# EAGLE schematic Dig_Stethoscope (EAGLE 9.0.1)
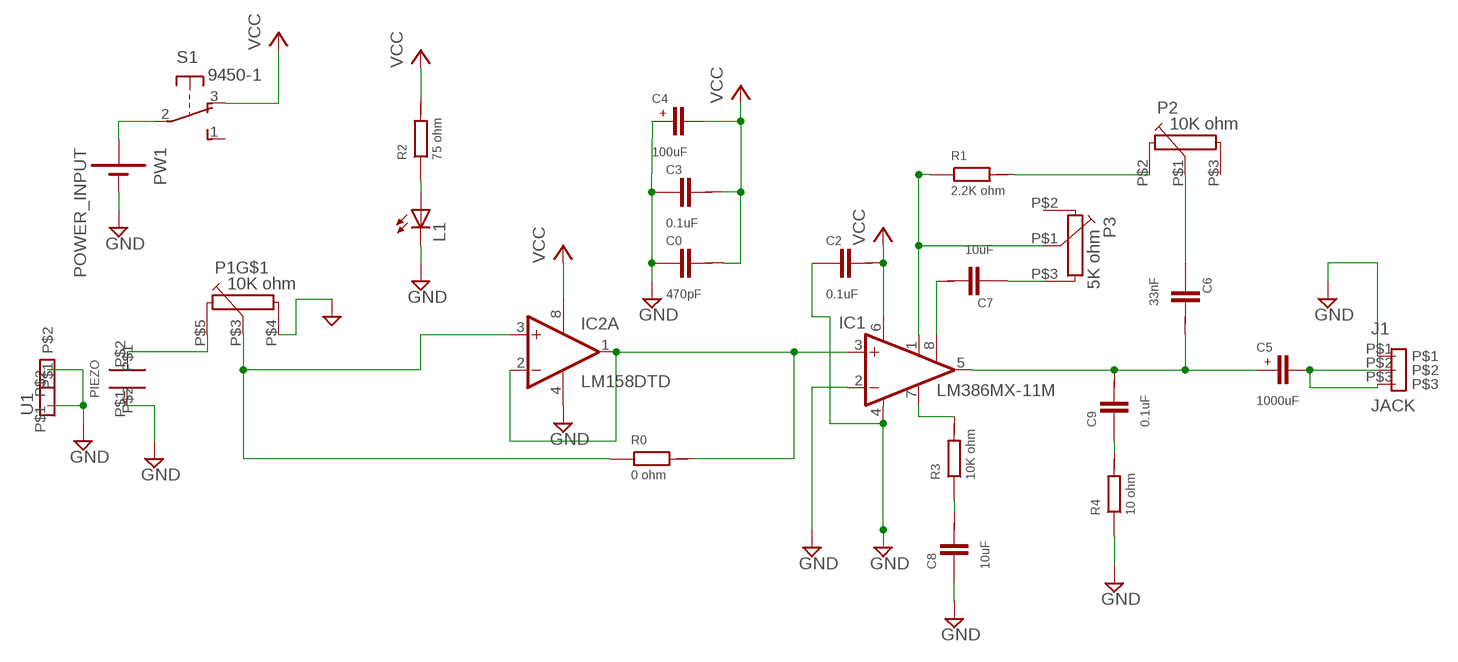
[diagram p0: schematic, sheet 1]

## Parts
C0  470pF  CAP_CERAMIC  [C0603K]
C2  0.1uF  CAP_CERAMIC  [C0603K]
C3  0.1uF  CAP_CERAMIC  [C0603K]
C4  100uF  CAP_100UF  [CAP_100UF]
C5  1000uF  CAP_1000UF  [CAP_1000F]
C6  33nF  CAP_CERAMIC  [C0603K]
C7  10uF  CAP_CERAMIC  [C0603K]
C8  10uF  CAP_CERAMIC  [C0603K]
C9  0.1uF  CAP_CERAMIC  [C0603K]
IC1  LM386MX-11M  [SO08]
IC2  LM158DTD  [SO08]
J1  JACK  [JACK]
L1  L140_LED  [LTW_LED]
P1  10K ohm  POT_DIP_REAR_MOUNT  [DIP_POT]
P2  10K ohm  TC33X-1/2  [TC33X-1/2]
P3  5K ohm  TC33X-1/2  [TC33X-1/2]
PIEZO  PIEZO_INPUT  [2_PIEZO_DIP]
PW1  POWER_INPUT  [2_POWER_DIP]
R0  0 ohm  RESISTOR  [C1206K]
R1  2.2K ohm  RESISTOR  [C1206K]
R2  75 ohm  RESISTOR  [C1206K]
R3  10K ohm  RESISTOR  [C1206K]
R4  10 ohm  RESISTOR  [C1206K]
S1  9450-1  [9450-1]
U1  CLAMP  [CLAMP]

## Nets
GND: C0.1 C2.1 C3.1 C4.P$2 C8.1 IC1.2(-IN) IC1.4(GND) IC2.4(P:V-) J1.P$1 L1.CATH_2(C) P1.P$1(GND) P1.P$2(GND) P1.P$4(1E) PIEZO.P$1 PW1.P$2(-) R4.1 U1.P$1 U1.P$2
N$2: IC2.3(A:+IN) P1.P$3(1S) R0.1
N$3: P1.P$5(1A) PIEZO.P$2
N$4: IC1.3(+IN) IC2.1(A:OUT) IC2.2(A:-IN) R0.2
N$5: C5.P$2 C6.2 C9.2 IC1.5(OUT)
N$6: IC1.1(GAIN) P3.P$1(1S) R1.1
N$8: P2.P$2(1A) R1.2
N$10: C6.1 P2.P$1(1S)
N$11: C7.1 P3.P$3(1E)
N$12: C7.2 IC1.8(GAIN)
N$13: L1.ANODE_1(A) R2.1
N$14: IC1.7(BYPASS) R3.2
N$15: C8.2 R3.1
N$16: C9.1 R4.2
N$17: PW1.P$1(+) S1.2(P)
N$18: C5.P$1 J1.P$2 J1.P$3
VCC: C0.2 C2.2 C3.2 C4.P$1 IC1.6(VS) IC2.8(P:V+) R2.2 S1.3(O)
Unconnected: IC2.5(B:+IN) IC2.6(B:-IN) IC2.7(B:OUT) P2.P$3(1E) P3.P$2(1A) S1.1(S)

## Library data of the parts
C0 C2 C3 C6-C9 = dig_steth:CAP_CERAMIC
C4 = dig_steth:CAP_100UF
C5 = dig_steth:CAP_1000UF
IC1 = dig_steth:LM386MX-1: Low Voltage Audio Power Amplifier Source: http://cache.national.com/ds/LM/LM386.pdf
IC2 = dig_steth:LM158DT: OP AMP also LM158; LM258; LM2904 Source: http://cache.national.com/ds/LM/LM158.pdf
J1 = dig_steth:JACK
L1 = dig_steth:L140_LED
P1 = dig_steth:POT_DIP_REAR_MOUNT
P2 P3 = dig_steth:TC33X-1/2
PIEZO = dig_steth:PIEZO_INPUT
PW1 = dig_steth:POWER_INPUT
R0 R1-R4 = dig_steth:RESISTOR
S1 = dig_steth:9450-1: MARQUARDT SWITCH
U1 = dig_steth:CLAMP